# EasyEDA schematic SCH_Electric-Kiln-Controller_EasyEDA.json

## Sheets
1 Sheet_1: TITLE: Sheet_1; REV: 1.0; Date: 2022-01-06; Sheet: 1/2; Drawn By: Pablo Llaguno; Company: Your Company
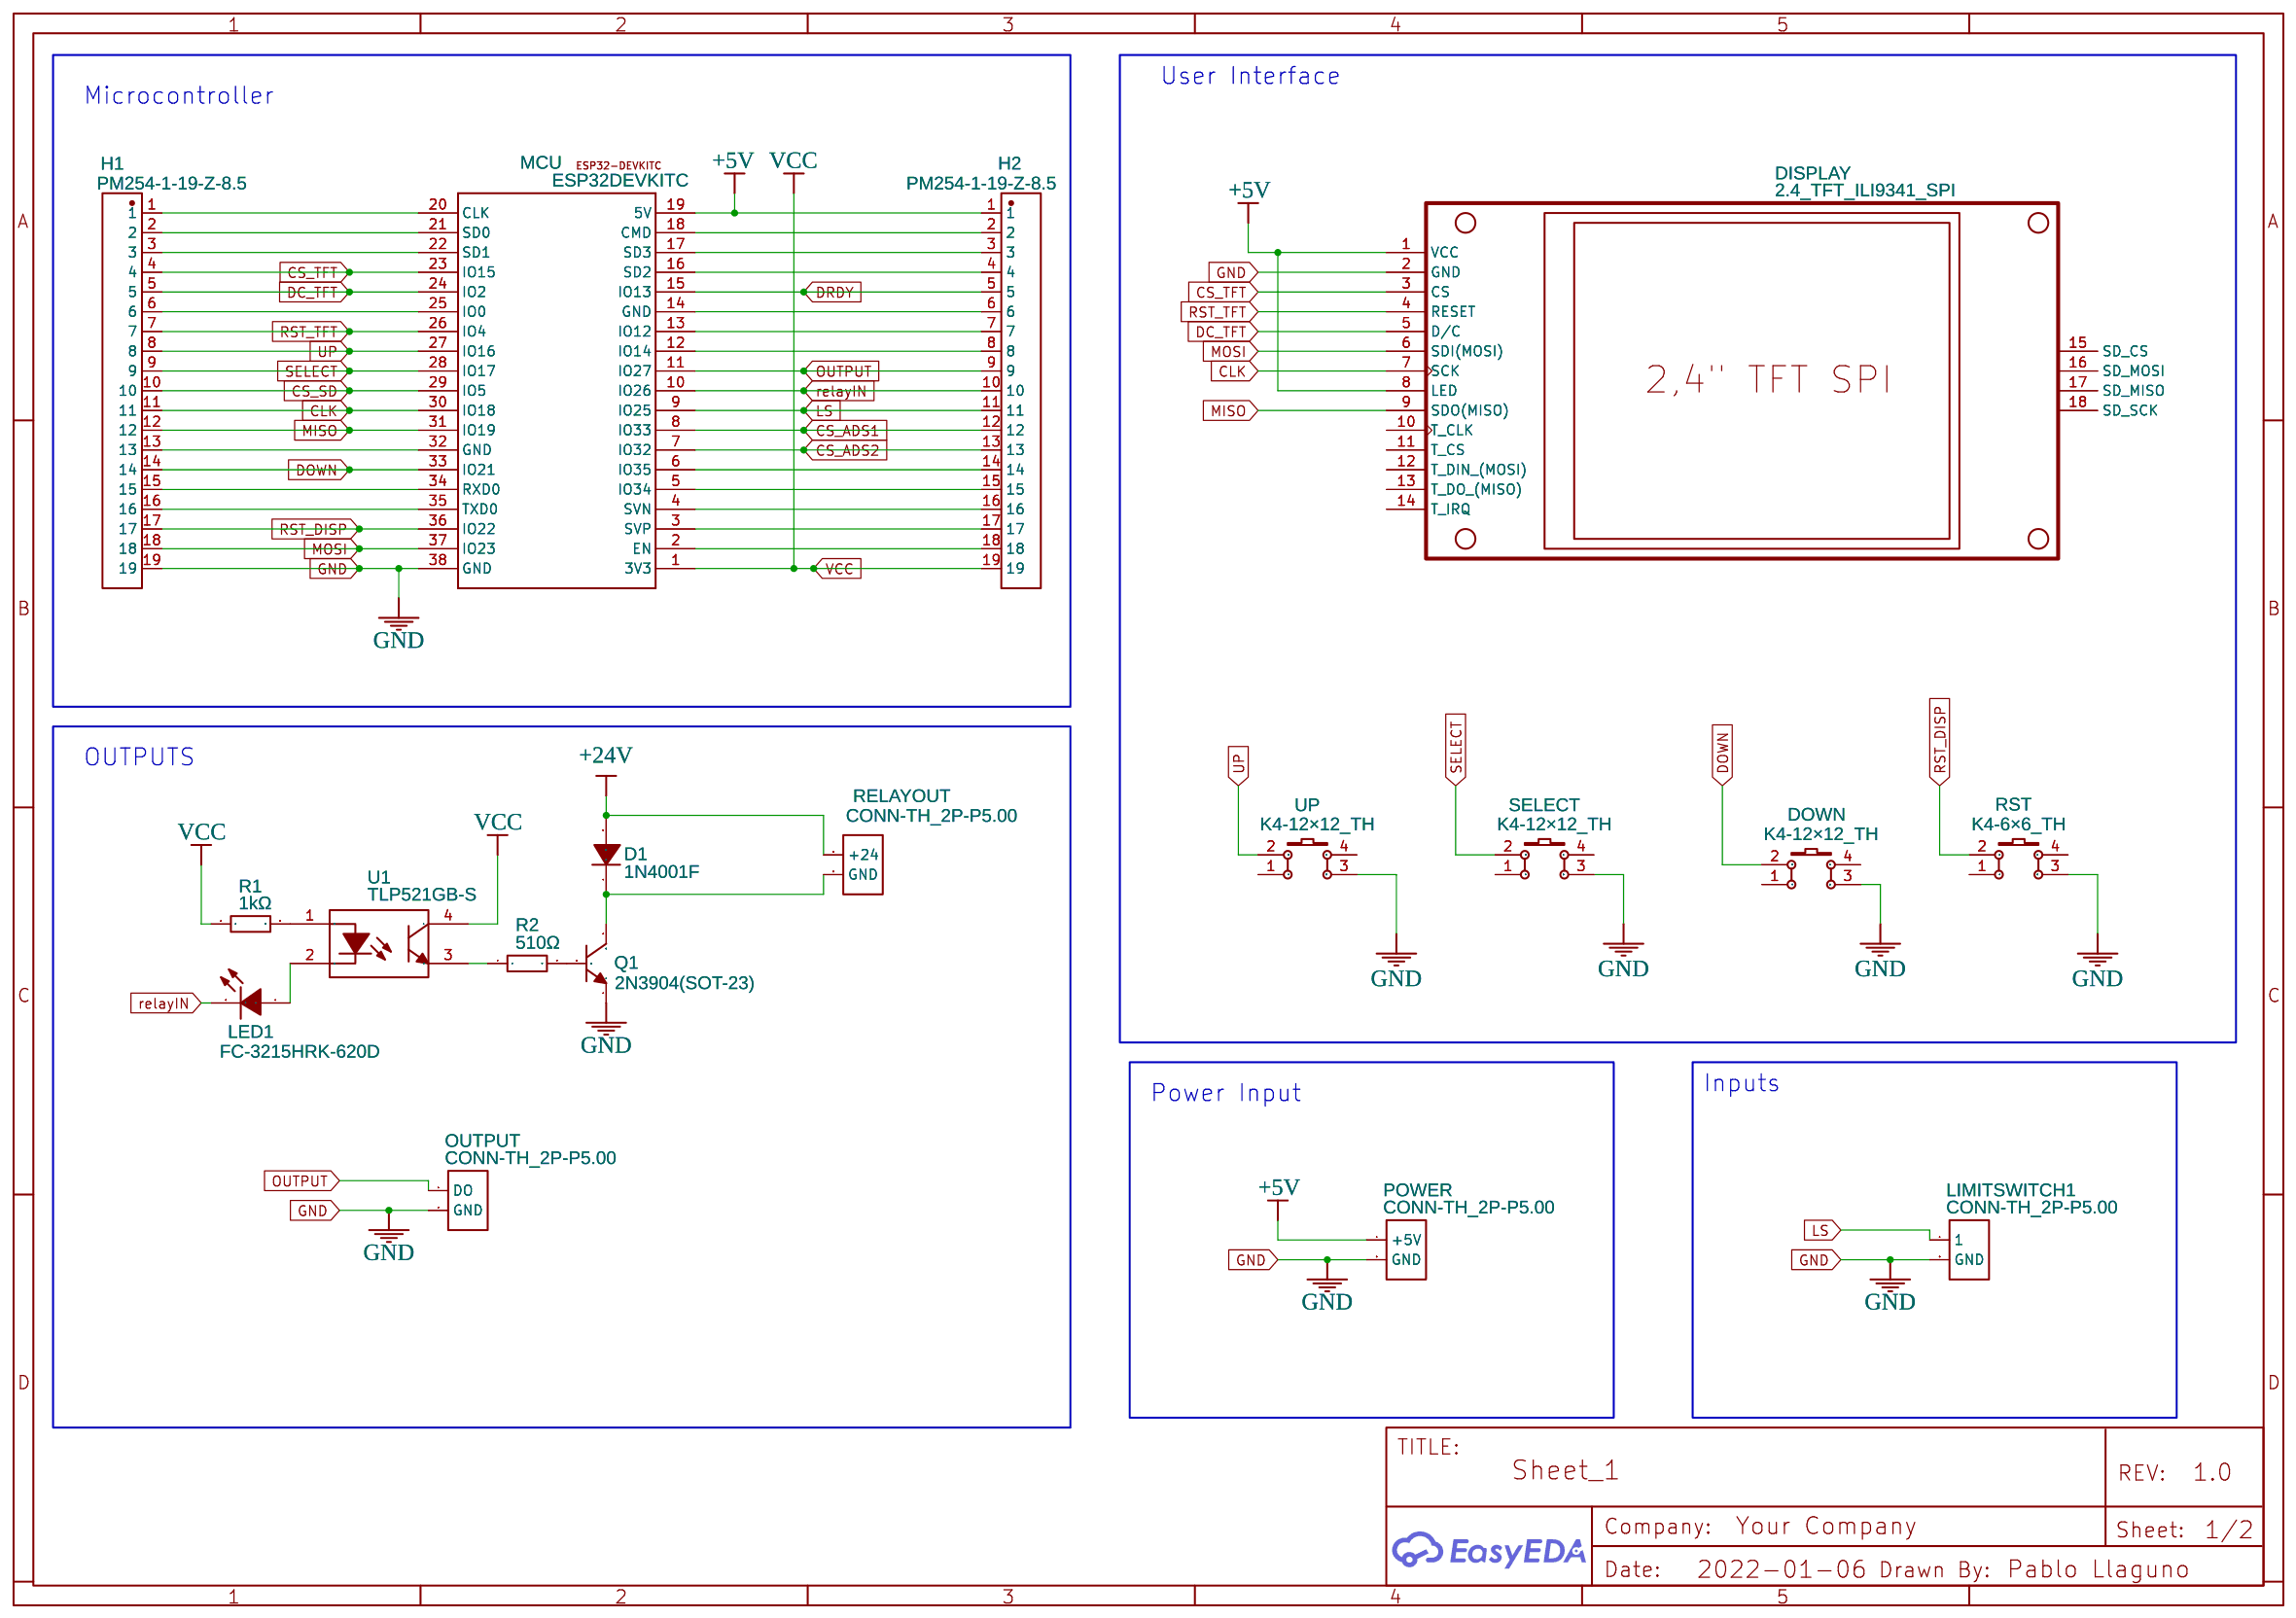
[diagram p0: Sheet_1]
2 Sheet_2: TITLE: Sheet_2; Date: 2024-01-25; Sheet: 2/2
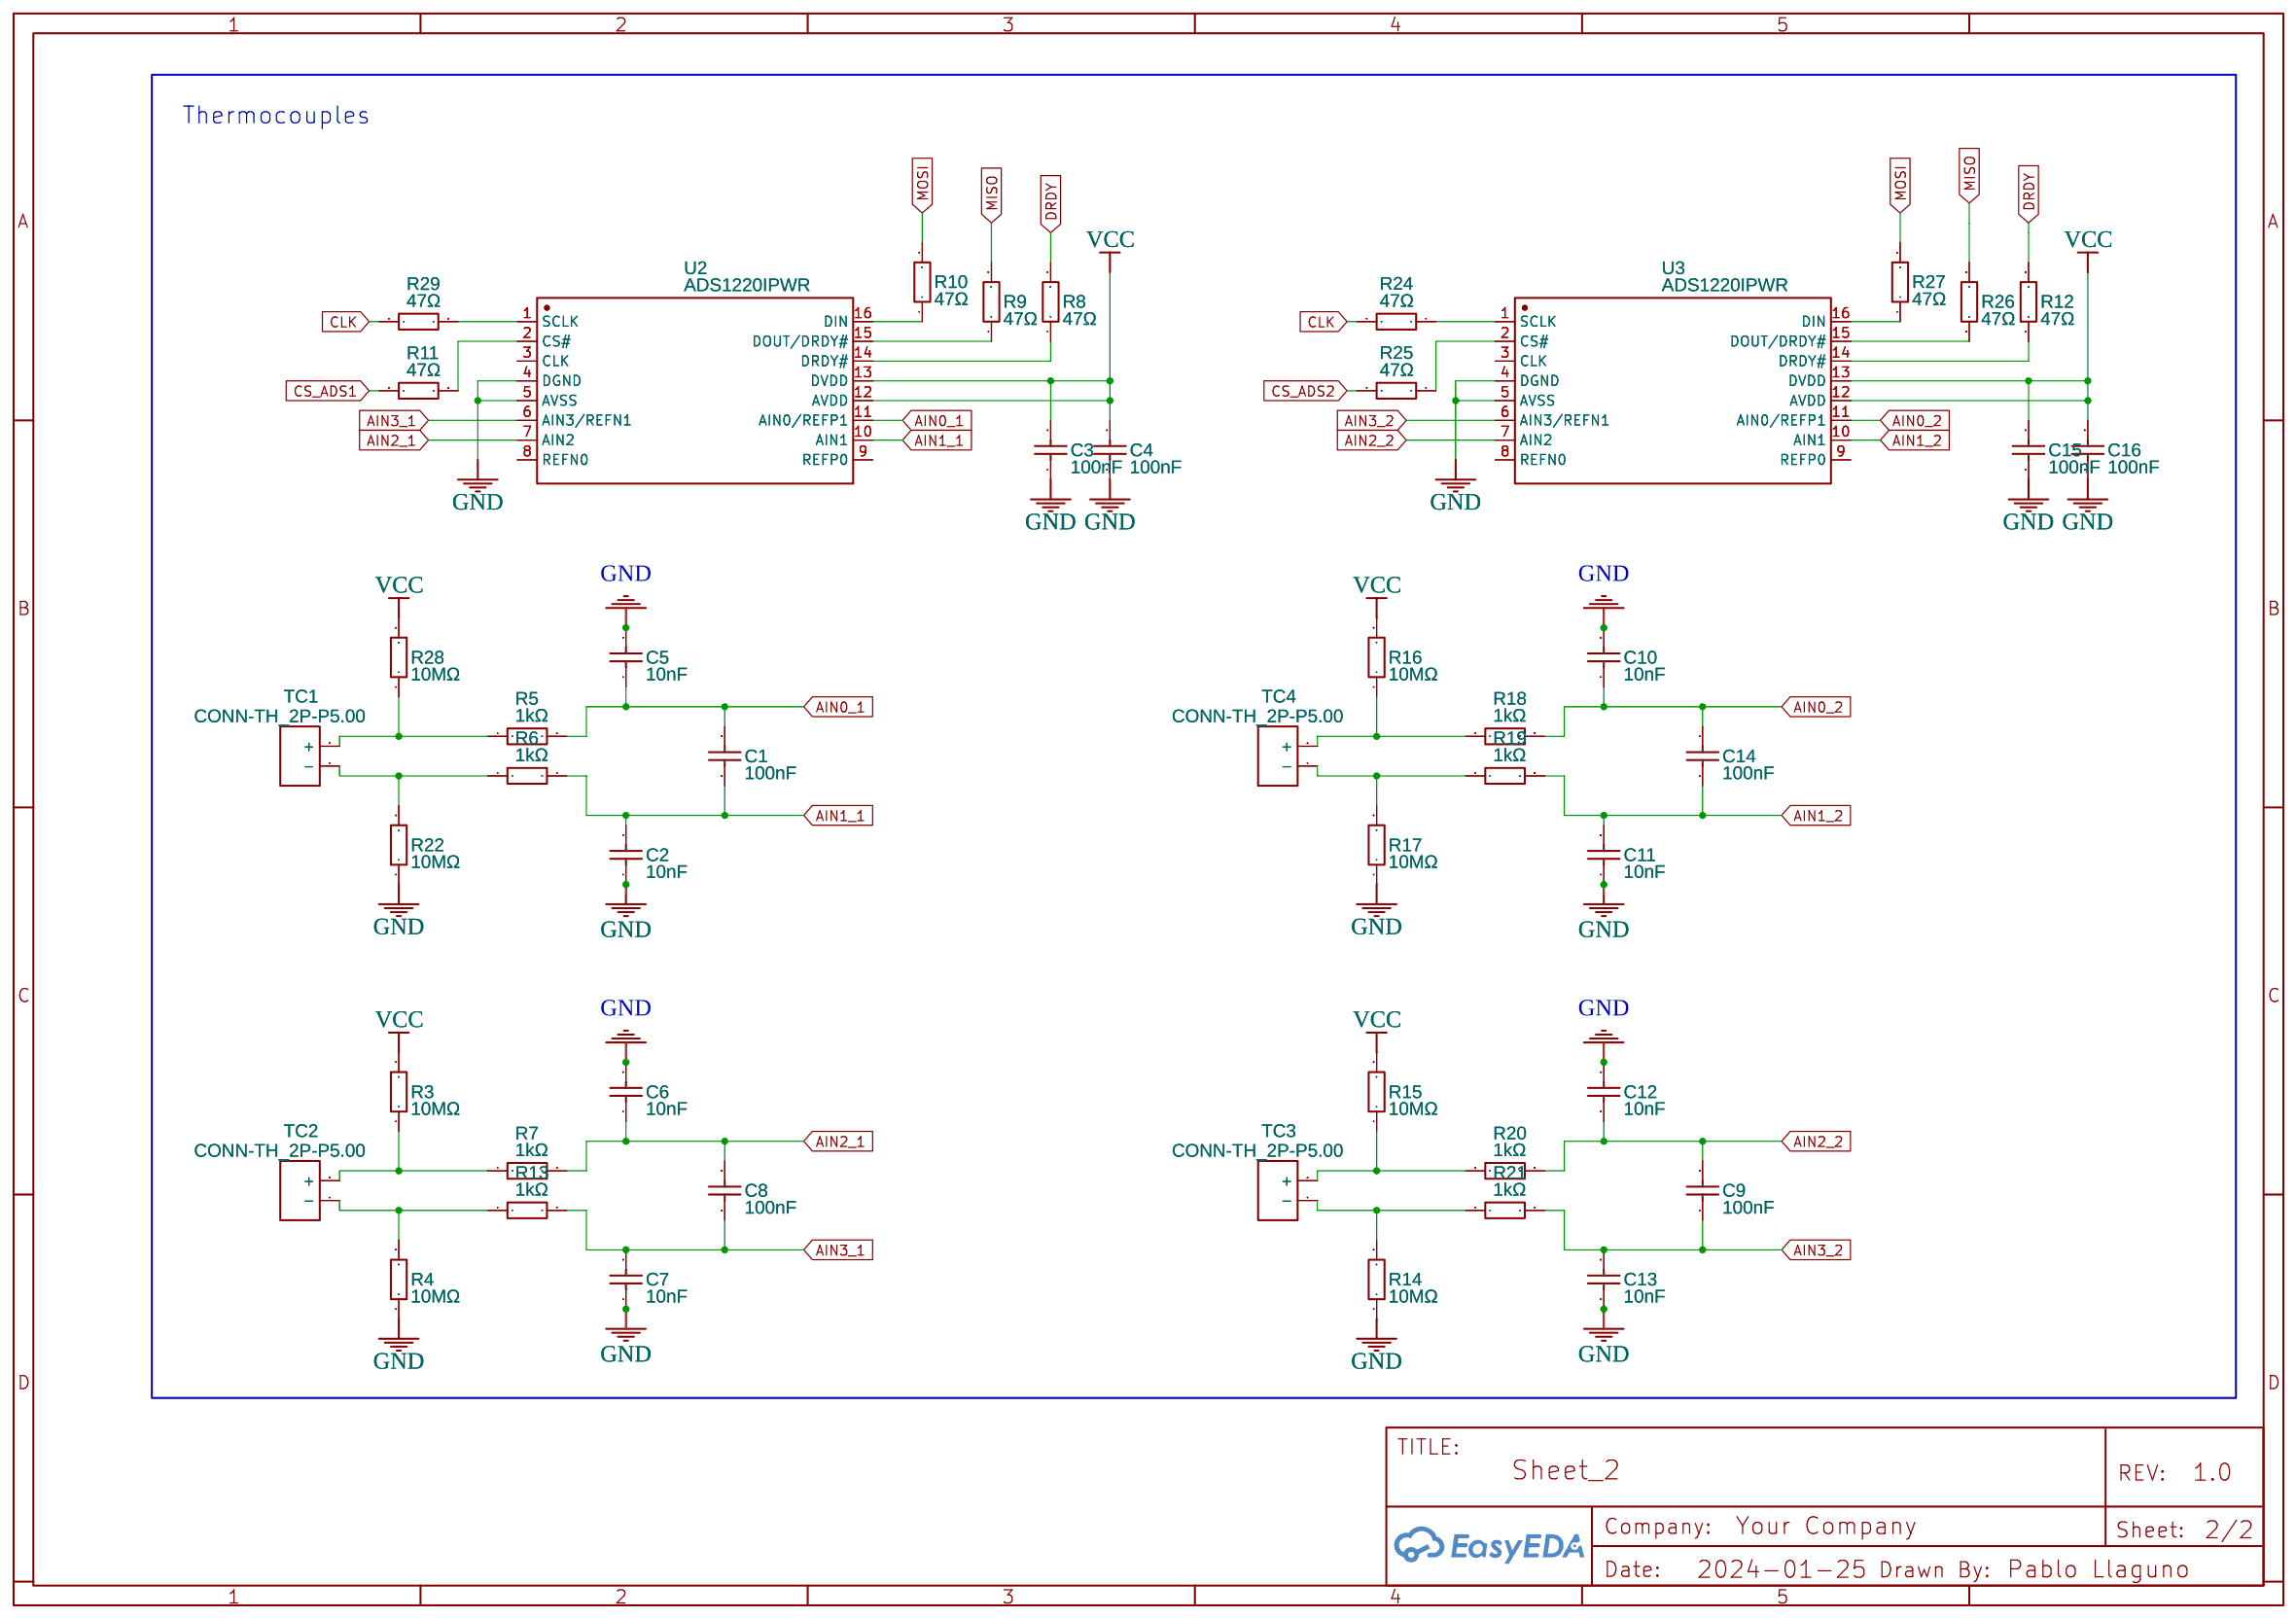
[diagram p1: Sheet_2]

## Parts
sheet Sheet_1
D1  1N4001F  [SMAF_L3.5-W2.6-LS4.7-RD]
DISPLAY  2.4_TFT_ILI9341_SPI  [2.4 TFT ILI9341 SPI]
DOWN  K4-12×12_TH  [KEY-TH_4P-L12.0-W12.0-P5.00-LS12.5]
H1  PM254-1-19-Z-8.5  [HDR-TH_19P-P2.54-V-F]
H2  PM254-1-19-Z-8.5  [HDR-TH_19P-P2.54-V-F]
LED1  FC-3215HRK-620D  [LED1206-R-RD_RED]
LIMITSWITCH1  CONN-TH_2P-P5.00  [CONN-TH_2P-P5.00]
MCU  ESP32DEVKITC  [ESP32-DEVKITC]
OUTPUT  CONN-TH_2P-P5.00  [CONN-TH_2P-P5.00]
POWER  CONN-TH_2P-P5.00  [CONN-TH_2P-P5.00]
Q1  2N3904(SOT-23)  [SOT-23-3_L2.9-W1.3-P1.90-LS2.4-TR]
R1  1kΩ  [R0603]
R2  510Ω  [R0603]
RELAYOUT  CONN-TH_2P-P5.00  [CONN-TH_2P-P5.00]
RST  K4-6×6_TH  [KEY-TH_4P-L6.0-W6.0-P4.50-LS6.5]
SELECT  K4-12×12_TH  [KEY-TH_4P-L12.0-W12.0-P5.00-LS12.5]
U1  TLP521GB-S  [OPTO-SMD-4_L6.5-W4.6-P2.54-LS10.0-TL]
UP  K4-12×12_TH  [KEY-TH_4P-L12.0-W12.0-P5.00-LS12.5]
sheet Sheet_2
C1  100nF  [C0805]
C2  10nF  [C0805]
C3  100nF  [C0805]
C4  100nF  [C0805]
C5  10nF  [C0805]
C6  10nF  [C0805]
C7  10nF  [C0805]
C8  100nF  [C0805]
C9  100nF  [C0805]
C10  10nF  [C0805]
C11  10nF  [C0805]
C12  10nF  [C0805]
C13  10nF  [C0805]
C14  100nF  [C0805]
C15  100nF  [C0805]
C16  100nF  [C0805]
R3  10MΩ  [R0603]
R4  10MΩ  [R0603]
R5  1kΩ  [R0603]
R6  1kΩ  [R0603]
R7  1kΩ  [R0603]
R8  47Ω  [R0603]
R9  47Ω  [R0603]
R10  47Ω  [R0603]
R11  47Ω  [R0603]
R12  47Ω  [R0603]
R13  1kΩ  [R0603]
R14  10MΩ  [R0603]
R15  10MΩ  [R0603]
R16  10MΩ  [R0603]
R17  10MΩ  [R0603]
R18  1kΩ  [R0603]
R19  1kΩ  [R0603]
R20  1kΩ  [R0603]
R21  1kΩ  [R0603]
R22  10MΩ  [R0603]
R24  47Ω  [R0603]
R25  47Ω  [R0603]
R26  47Ω  [R0603]
R27  47Ω  [R0603]
R28  10MΩ  [R0603]
R29  47Ω  [R0603]
TC1  CONN-TH_2P-P5.00  [CONN-TH_2P-P5.00]
TC2  CONN-TH_2P-P5.00  [CONN-TH_2P-P5.00]
TC3  CONN-TH_2P-P5.00  [CONN-TH_2P-P5.00]
TC4  CONN-TH_2P-P5.00  [CONN-TH_2P-P5.00]
U2  ADS1220IPWR  [TSSOP-16_L5.0-W4.4-P0.65-LS6.4-BL]
U3  ADS1220IPWR  [TSSOP-16_L5.0-W4.4-P0.65-LS6.4-BL]

## Library data of the parts
D1 = 1N4001F: Supplier: LCSC; Manufacturer: SHIKUES(时科); Supplier Part: C122841; JLCPCB Part Class: Extended Part
DISPLAY = 2.4_TFT_ILI9341_SPI: Contributor: Pablo Llaguno; Supplier Part: ili9341-24-touch; Supplier: Nettigo; Author: Krzysztof Daszuta; sourceId: sMic5nFXR
DOWN SELECT UP = K4-12×12_TH: Supplier Part: C128053; Supplier: LCSC; Manufacturer: 韩国韩荣; Manufacturer Part: K2-1103DP-M4SW-04; Contributor: LCEDA_Lib
H1 H2 = PM254-1-19-Z-8.5: Supplier: LCSC; Supplier Part: C2897382; Manufacturer: HCTL(华灿天禄); Contributor: LCSC; JLCPCB Part Class: Extended Part
LED1 = FC-3215HRK-620D: Supplier: LCSC; Manufacturer: 国星光电; Manufacturer Part: NCD1206R1; Supplier Part: C84270
LIMITSWITCH1 OUTPUT POWER RELAYOUT TC1-TC4 = CONN-TH_2P-P5.00: Supplier: LCSC; Contributor: LCEDA_Lib
MCU = ESP32DEVKITC: Contributor: Jan “Alpi” Mannsbart
Q1 = 2N3904(SOT-23): Supplier: LCSC; Manufacturer: KEC; Manufacturer Part: 2n3904S-RTK/PS; Supplier Part: C18536; Paste Type: SOT-23; Contributor: LCEDA_Lib
R1 R5-R7 R13 R18-R21 = 0603WAF1001T5E: Supplier: LCSC; Manufacturer: UNI-ROYAL(厚声); Supplier Part: C21190; JLCPCB Part Class: Basic Part
R2 = 0603WAF5100T5E: Supplier: LCSC; Manufacturer: UNI-ROYAL(厚声); Supplier Part: C23193; JLCPCB Part Class: Basic Part
RST = K4-6×6_TH: Supplier: LCSC; Supplier Part: C136684; Manufacturer: 韩国韩荣; Manufacturer Part: K2-1102DP-E4SW-04; Contributor: LCEDA_Lib
U1 = TLP521GB-S: Contributor: LCSC; Supplier: LCSC; Supplier Part: C364143; Manufacturer: UMW(广东友台半导体); JLCPCB Part Class: Extended Part
C1 C3 C4 C8 C9 C14-C16 = CL21B104KCFNNNE: Supplier: LCSC; Manufacturer: SAMSUNG(三星); Supplier Part: C28233; JLCPCB Part Class: Basic Part
C2 C5-C7 C10-C13 = CL21B103KBANNNC: Supplier: LCSC; Manufacturer: SAMSUNG(三星); Supplier Part: C1710; JLCPCB Part Class: Basic Part
R3 R4 R14-R17 R22 = 0603WAJ0106T5E: Supplier: LCSC; Manufacturer: UNI-ROYAL(厚声); Supplier Part: C26097; JLCPCB Part Class: Extended Part
R8-R12 R24-R27 R29 = 0603WAJ0470T5E: Supplier: LCSC; Manufacturer: UNI-ROYAL(厚声); Supplier Part: C1211; JLCPCB Part Class: Extended Part
R28 = 0603WAJ0106T5E: Supplier: LCSC; Manufacturer: UNI-ROYAL(厚声); Supplier Part: C26097; JLCPCB Part Class: Extended Part; Package Display: No
U2 U3 = ADS1220IPWR: Supplier: LCSC; Manufacturer: TI(德州仪器); Supplier Part: C48263; JLCPCB Part Class: Extended Part

## Nets
+5V: DISPLAY.1(VCC) DISPLAY.8(LED) H2.1 MCU.19(5V) POWER.1(+5V)
+24V: D1.2(A) RELAYOUT.1(+24)
GND: C2.1 C3.1 C4.1 C5.2 C6.2 C7.1 C10.2 C11.1 C12.2 C13.1 C15.1 C16.1 DISPLAY.2(GND) DOWN.3 H1.19 LIMITSWITCH1.2(GND) MCU.38(GND) OUTPUT.2(GND) POWER.2(GND) Q1.1(E) R4.1 R14.1 R17.1 R22.1 RST.3 SELECT.3 U2.4(DGND) U2.5(AVSS) U3.4(DGND) U3.5(AVSS) UP.3
VCC: C3.2 C4.2 C15.2 C16.2 H2.19 MCU.1(3V3) R1.1 R3.2 R15.2 R16.2 R28.2 U1.4 U2.12(AVDD) U2.13(DVDD) U3.12(AVDD) U3.13(DVDD)
AIN0_1: C1.2 C5.1 R5.2 U2.11(AIN0/REFP1)
AIN0_2: C10.1 C14.2 R18.2 U3.11(AIN0/REFP1)
AIN1_1: C1.1 C2.2 R6.2 U2.10(AIN1)
AIN1_2: C11.2 C14.1 R19.2 U3.10(AIN1)
AIN2_1: C6.1 C8.2 R7.2 U2.7(AIN2)
AIN2_2: C9.2 C12.1 R20.2 U3.7(AIN2)
AIN3_1: C7.2 C8.1 R13.2 U2.6(AIN3/REFN1)
AIN3_2: C9.1 C13.2 R21.2 U3.6(AIN3/REFN1)
CLK: DISPLAY.7(SCK) H1.11 MCU.30(IO18) R24.2 R29.1
CS_ADS1: H2.12 MCU.8(IO33) R11.1
CS_ADS2: H2.13 MCU.7(IO32) R25.2
CS_SD: H1.10 MCU.29(IO5)
CS_TFT: DISPLAY.3(CS) H1.4 MCU.23(IO15)
DC_TFT: DISPLAY.5(D/C) H1.5 MCU.24(IO2)
DOWN: DOWN.2 H1.14 MCU.33(IO21)
DRDY: H2.5 MCU.15(IO13) R8.2 R12.2
LS: H2.11 LIMITSWITCH1.1 MCU.9(IO25)
MISO: DISPLAY.9(SDO(MISO)) H1.12 MCU.31(IO19) R9.2 R26.2
MOSI: DISPLAY.6(SDI(MOSI)) H1.18 MCU.37(IO23) R10.2 R27.2
OUTPUT: H2.9 MCU.11(IO27) OUTPUT.1(DO)
relayIN: H2.10 LED1.2(K) MCU.10(IO26)
RST_DISP: H1.17 MCU.36(IO22) RST.2
RST_TFT: DISPLAY.4(RESET) H1.7 MCU.26(IO4)
SELECT: H1.9 MCU.28(IO17) SELECT.2
UP: H1.8 MCU.27(IO16) UP.2
Net-(D1-1): D1.1(C) Q1.3(C) RELAYOUT.2(GND)
Net-(H1-1): H1.1 MCU.20(CLK)
Net-(H1-2): H1.2 MCU.21(SD0)
Net-(H1-3): H1.3 MCU.22(SD1)
Net-(H1-6): H1.6 MCU.25(IO0)
Net-(H1-13): H1.13 MCU.32(GND)
Net-(H1-15): H1.15 MCU.34(RXD0)
Net-(H1-16): H1.16 MCU.35(TXD0)
Net-(H2-2): H2.2 MCU.18(CMD)
Net-(H2-3): H2.3 MCU.17(SD3)
Net-(H2-4): H2.4 MCU.16(SD2)
Net-(H2-6): H2.6 MCU.14(GND)
Net-(H2-7): H2.7 MCU.13(IO12)
Net-(H2-8): H2.8 MCU.12(IO14)
Net-(H2-14): H2.14 MCU.6(IO35)
Net-(H2-15): H2.15 MCU.5(IO34)
Net-(H2-16): H2.16 MCU.4(SVN)
Net-(H2-17): H2.17 MCU.3(SVP)
Net-(H2-18): H2.18 MCU.2(EN)
Net-(LED1-1): LED1.1(A) U1.2
Net-(Q1-2): Q1.2(B) R2.2
Net-(R1-2): R1.2 U1.1
Net-(R2-1): R2.1 U1.3
Net-(R3-1): R3.1 R7.1 TC2.2(+)
Net-(R4-2): R4.2 R13.1 TC2.1(-)
Net-(R5-1): R5.1 R28.1 TC1.2(+)
Net-(R6-1): R6.1 R22.2 TC1.1(-)
Net-(R8-1): R8.1 U2.14(DRDY#)
Net-(R9-1): R9.1 U2.15(DOUT/DRDY#)
Net-(R10-1): R10.1 U2.16(DIN)
Net-(R11-2): R11.2 U2.2(CS#)
Net-(R12-1): R12.1 U3.14(DRDY#)
Net-(R14-2): R14.2 R21.1 TC3.1(-)
Net-(R15-1): R15.1 R20.1 TC3.2(+)
Net-(R16-1): R16.1 R18.1 TC4.2(+)
Net-(R17-2): R17.2 R19.1 TC4.1(-)
Net-(R24-1): R24.1 U3.1(SCLK)
Net-(R25-1): R25.1 U3.2(CS#)
Net-(R26-1): R26.1 U3.15(DOUT/DRDY#)
Net-(R27-1): R27.1 U3.16(DIN)
Net-(R29-2): R29.2 U2.1(SCLK)

Not connected (* = marked no-connect by the designer): DISPLAY 10(T_CLK) 11(T_CS) 12(T_DIN (MOSI)) 13(T_DO (MISO)) 14(T_IRQ) 15(SD_CS) 16(SD_MOSI) 17(SD_MISO) 18(SD_SCK); DOWN 1 4; RST 1 4; SELECT 1 4; U2 3(CLK) 8(REFN0) 9(REFP0); U3 3(CLK) 8(REFN0) 9(REFP0); UP 1 4

## Notes on the sheets
sheet 1
- User Interface
- Microcontroller
- OUTPUTS
- Inputs
- Power Input
sheet 2
- Thermocouples
